# Altium schematic sheet microSD.SchDoc
size A4; SheetNumber: 5; SheetTotal: 5
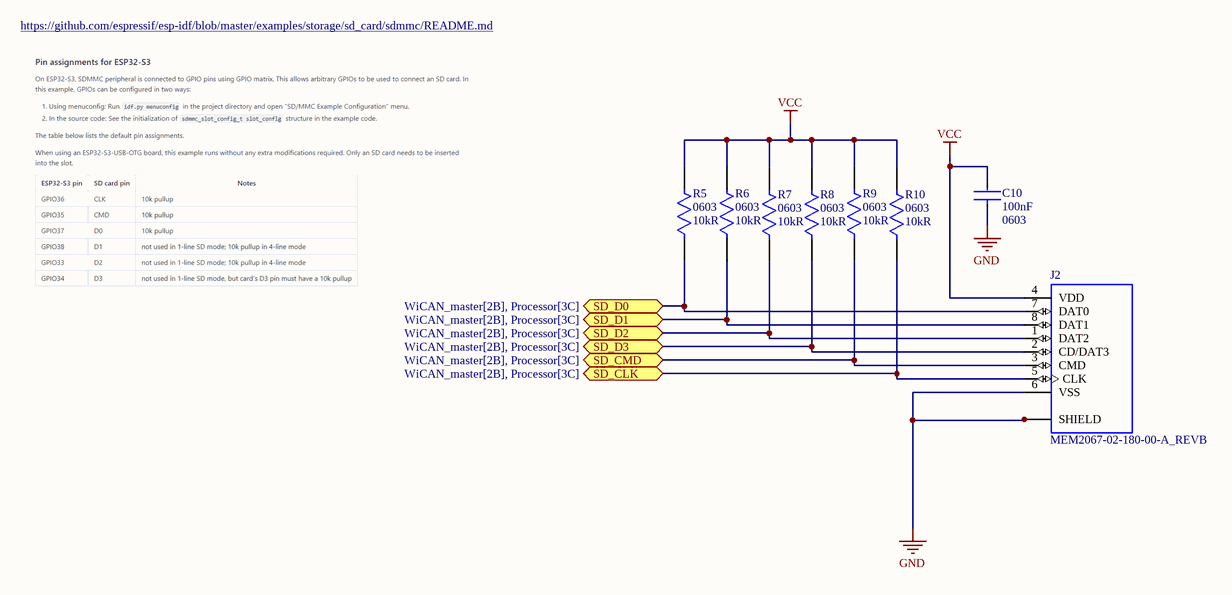
[diagram p0: microSD.SchDoc]

## Parts
C10  Capacitance: 100nF  Case/Package: 0603  [FP-CL10-IPC_A]  (hidden comment: CL10B104KB8WPNC)
J2  MEM2067-02-180-00-A_REVB  [GCT_MEM2067-02-180-00-A_REVB]
R5  Case Code (Imperial): 0603  Resistance: 10kR  [FP-RMCF0603-MFG]  (hidden comment: RMCF0603JG10K0)
R6  Case Code (Imperial): 0603  Resistance: 10kR  [FP-RMCF0603-MFG]  (hidden comment: RMCF0603JG10K0)
R7  Case Code (Imperial): 0603  Resistance: 10kR  [FP-RMCF0603-MFG]  (hidden comment: RMCF0603JG10K0)
R8  Case Code (Imperial): 0603  Resistance: 10kR  [FP-RMCF0603-MFG]  (hidden comment: RMCF0603JG10K0)
R9  Case Code (Imperial): 0603  Resistance: 10kR  [FP-RMCF0603-MFG]  (hidden comment: RMCF0603JG10K0)
R10  Case Code (Imperial): 0603  Resistance: 10kR  [FP-RMCF0603-MFG]  (hidden comment: RMCF0603JG10K0)

## Ports
SD_CLK (bidir, see WiCAN_master[2B], Processor[3C]), SD_CMD (bidir, see WiCAN_master[2B], Processor[3C]), SD_D0 (bidir, see WiCAN_master[2B], Processor[3C]), SD_D1 (bidir, see WiCAN_master[2B], Processor[3C]), SD_D2 (bidir, see WiCAN_master[2B], Processor[3C]), SD_D3 (bidir, see WiCAN_master[2B], Processor[3C])

## Nets
GND: C10.1 J2.6(VSS) J2.9(SHIELD) J2.10(SHIELD) J2.11(SHIELD) J2.12(SHIELD)
VCC: C10.2 J2.4(VDD) R5.2 R6.2 R7.2 R8.2 R9.2 R10.2
SD_CLK: J2.5(CLK) R10.1 ; port SD_CLK
SD_CMD: J2.3(CMD) R9.1 ; port SD_CMD
SD_D0: J2.7(DAT0) R5.1 ; port SD_D0
SD_D1: J2.8(DAT1) R6.1 ; port SD_D1
SD_D2: J2.1(DAT2) R7.1 ; port SD_D2
SD_D3: J2.2(CD/DAT3) R8.1 ; port SD_D3

## Notes on the sheet
- https://github.com/espressif/esp-idf/blob/master/examples/storage/sd_card/sdmmc/README.md

## Library data of the parts
C10 = CMP-13271-002353-1: Cap Ceramic 100nF 50V X7R ±10% Pad SMD 0603 +125°C T/R; Ratings: AEC-Q200; Features: Soft Termination; Max Operating Temperature: 125°C; Mount: Surface Mount; Width: 0.031inch; Voltage Rating: 50V; Case Code (Metric): 1608; Case Code (Imperial): 0603; Tolerance: 10%; Min Operating Temperature: -55°C; Thickness: 0.035inch; Lead Free: Lead Free; Packaging: Tape and Reel; Length: 0.063inch
J2 = MEM2067-02-180-00-A_REVB: Micro SD Memory Card ConnectorSMT, Hinged, 1.80mm Profile; Value: *; MP: MEM2067-02-180-00-A_REVB; Package: None; Availability: Unavailable; Price: None
R5-R10 = CMP-26527-000153-1: 10kΩ ±5% 0.1W 0603 Thick Film Chip Resistor AEC-Q200 compliant; Temperature Coefficient: 200ppm/°C; Max Power Dissipation: 100mW; Tolerance: 5%; Series: RMCF; Resistor Type: Thick Film; Length: 0.061inch; Features: Automotive AEC-Q200; Height: 0.022inch; Case Code (Metric): 1608; Width: 0.031inch; Number of Terminations: 2; Contact Plating: Tin; Case/Package: 0603; Package Quantity: 1; Max Operating Temperature: 155°C; Mount: Surface Mount; RoHS Compliant: Yes; Radiation Hardening: No; Min Operating Temperature: -55°C; Packaging: Tape and Reel